# Altium project PCB_Project.PrjPcb
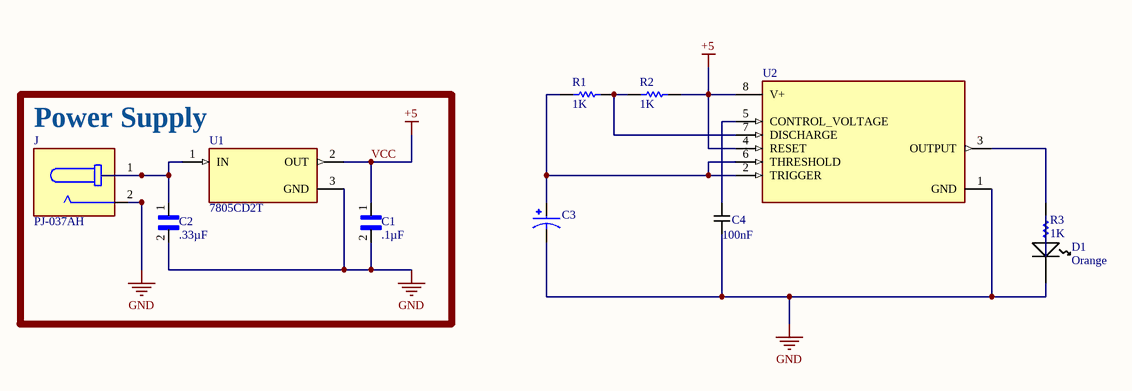
[diagram p0: Sheet1.SchDoc]
1 sheet, 11 parts. Net scope: global (net labels, ports and power ports of the same name join across sheets).
Board file: PCB1.PcbDoc

## Sheet Sheet1.SchDoc
size A; SheetNumber: 1; SheetTotal: 1

### Parts
C1  .1µF  [CAPC3216X190N]
C2  .33µF  [CAPC3216X190N]
C3  EEUED2G100  [CAPPRD500W60D1000H2000]  (value not drawn)
C4  Capacitance: 100nF  [CAPCP2012X09N]  (hidden comment: 100nF Ceramic Multilayer Capacitor_1)
D1  Color: Orange  [LED1913X12NYEL/ORANGE]  (hidden comment: Kingbright Orange LED, 200 mcd 120 ° 0805)
J  PJ-037AH  [CUI_PJ-037AH]
R1  value 1K  [RES_ERJS03F1001V]  (hidden comment: Resistor)
R2  value 1K  [RES_ERJS03F1001V]  (hidden comment: Resistor)
R3  value 1K  [RES_ERJS03F1001V]  (hidden comment: Resistor)
U1  7805CD2T  [TO254P1542X460-3N]
U2  LM555CM/NOPB  [SOIC127P599X175-8N]  (value not drawn)

### Blocks framed on the sheet
Power Supply: C1 C2 J U1

### Nets
GND: C1.2 C2.2 C3.N C4.1 D1.2(K) J.2 U1.3(GND) U2.1(GND)
VCC: C1.1 R2.1 U1.2(OUT) U2.4(RESET) U2.8(V+)  [also labelled +5]
NetC2_1: C2.1 J.1 U1.1(IN)
NetC3_P: C3.P R1.1 U2.2(TRIGGER) U2.6(THRESHOLD)
NetC4_2: C4.2 U2.5(CONTROL_VOLTAGE)
NetD1_1: D1.1(A) R3.1
NetR1_2: R1.2 R2.2 U2.7(DISCHARGE)
NetR3_2: R3.2 U2.3(OUTPUT)

### Library data of the parts
C1 C2 = GRM31CR60J227ME11L: SMD Multilayer Ceramic Capacitor, GRM Series, 220 F, 20%, X5R, 6.3 V, 1206 [3216 Metric]; MF: Murata Electronics; Digi-Key_Part_Number: 490-13970-1-ND; Package: 3216 Murata; MP: GRM31CR60J227ME11L; SnapEDA_Link: https://www.snapeda.com/parts/GRM31CR60J227ME11L/Murata%20Electronics%20North%20America/view-part/1756709/?ref=snap; Purchase-URL: https://pricing.snapeda.com/search/part/GRM31CR60J227ME11L/?ref=eda; Check_prices: https://www.snapeda.com/parts/GRM31CR60J227ME11L/Murata%20Electronics%20North%20America/view-part/1756709/?ref=eda; Value: *
C3 = EEUED2G100: 10F 400V Aluminum Electrolytic Capacitors Radial, Can 8000 Hrs @ 105C; MF: Panasonic Electronic; MP: EEU-ED2G100; SnapEDA_Link: https://www.snapeda.com/parts/EEU-ED2G100/Panasonic+Electronic+Components/view-part/?ref=snap; Package: RADIAL-2 Panasonic; Value: *; Check_prices: https://www.snapeda.com/parts/EEU-ED2G100/Panasonic+Electronic+Components/view-part/?ref=eda
C4 = 100nF Ceramic Multilayer Capacitor_1: AVX 0805 Standard 100nF Ceramic Multilayer Capacitor, 50 V dc X7R Dielectric ±10% SMD; Voltage: 50V; Creator: Ritesh Kanjee; Date Created: 18 February 2015; Package: 0805; Manufacturer: AVX; RS Stock No.: 464-6688; Datasheet URL: http://za.rs-online.com/web/p/ceramic-multilayer-capacitors/4646688/
D1 = Kingbright Orange LED, 200 mcd 120 ° 0805: Manufacturer Part No.: KP-2012SEC; Forward Voltage: 1.85V; Creator: Ritesh Kanjee; Date Created: 18 February 2015; Manufacturer: KingBright; RS Stock No.: 466-3790; Datasheet URL: http://za.rs-online.com/web/p/visible-leds/4663790/
J = PJ-037AH: 2.0 x 6.5 mm, 5.0 A, Horizontal, Through Hole, Dc Power Jack Connector; MF: CUI Devices; SnapEDA_Link: https://www.snapeda.com/parts/PJ-037AH/CUI+Devices/view-part/?ref=snap; Package: None; Value: *; CUI_purchase_URL: https://www.cuidevices.com/product/interconnect/connectors/dc-power-connectors/jacks/pj-037ah?utm_source=snapeda.com&utm_medium=referral&utm_campaign=snapedaBOM; MP: PJ-037AH; Check_prices: https://www.snapeda.com/parts/PJ-037AH/CUI+Devices/view-part/?ref=eda
R1-R3 = Resistor: TC1: 0; SimulationGenericComponent: True; TC2: 0
U1 = 7805CD2T: Linear Voltage Regulator IC Positive Fixed 1 Output 1.5A D2PAK; MF: STMicroelectronics; SnapEDA_Link: https://www.snapeda.com/parts/7805CD2T/STMicroelectronics/view-part/?ref=snap; Package: D2PAK STMicroelectronics; Value: *; MP: 7805CD2T; Check_prices: https://www.snapeda.com/parts/7805CD2T/STMicroelectronics/view-part/?ref=eda
U2 = LM555CM/NOPB: Highly Stable 555 Timer; MF: Texas Instruments; Price: None; Availability: In Stock; Package: SOIC-8 Texas Instruments; MP: LM555CM/NOPB; Value: *; SnapEDA_Link: https://www.snapeda.com/parts/LM555CM/NOPB/Texas+Instruments/view-part/?ref=snap; Purchase-URL: https://pricing.snapeda.com/search/part/LM555CM/NOPB/?ref=eda; Check_prices: https://www.snapeda.com/parts/LM555CM/NOPB/Texas+Instruments/view-part/?ref=eda